# EasyEDA Pro project 2025_07_18_ftdi.epro

# Schematic Schematic1
Board Name: Board1; Create Date: 2025-07-18; Page Name: P1; Project Name: 2025_07_18_ftdi; Schematic Name: Schematic1; Update Date: 2025-07-18; Company: EasyEDA.com; Page Size: A4; Version: V1.0
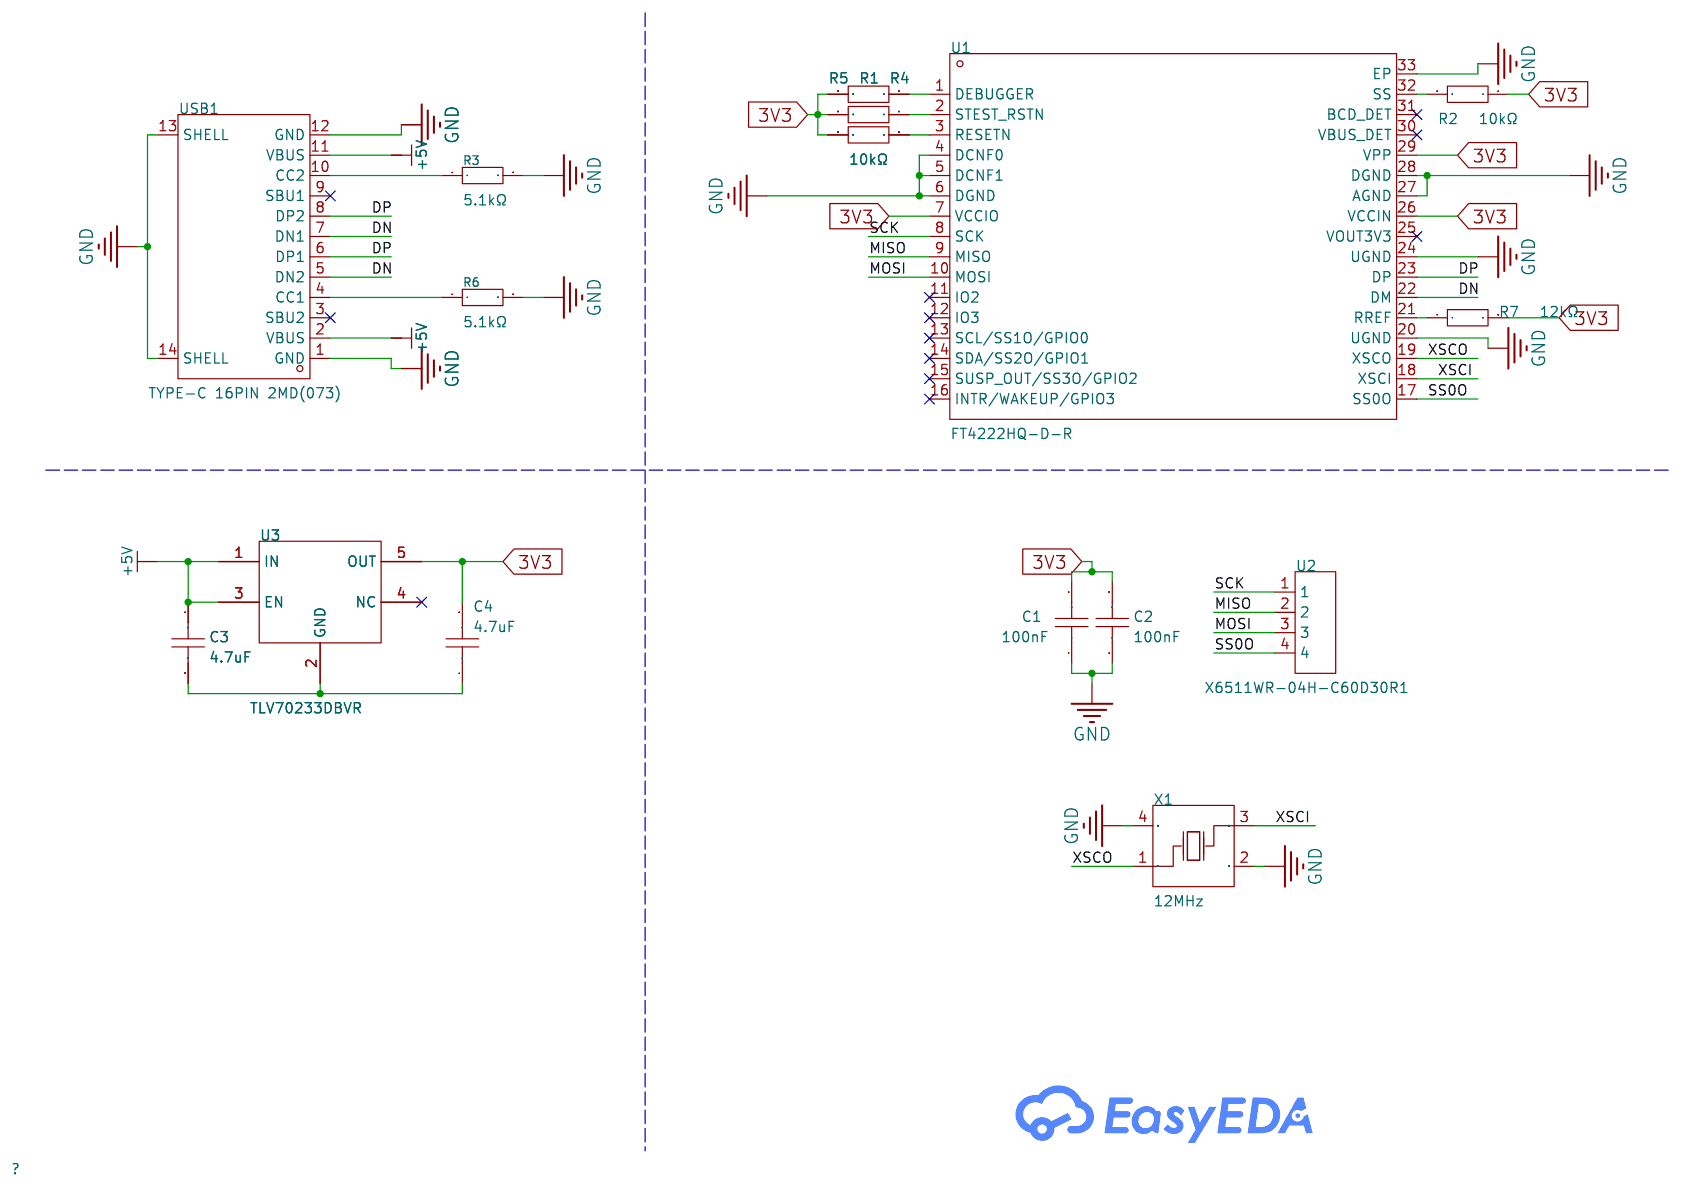
[diagram p0: schematic sheet]

## Parts
C1  100nF  [C0402]
C2  100nF  [C0402]
C3  4.7uF  [C0402]
C4  4.7uF  [C0402]
R1  10kΩ  [R0603]
R2  10kΩ  [R0603]
R3  5.1kΩ  [R0402]
R4  10kΩ  [R0603]
R5  10kΩ  [R0603]
R6  5.1kΩ  [R0402]
R7  12kΩ  [R0402]
U1  FT4222HQ-D-R  [QFN-32_L5.0-W5.0-P0.50-BL-EP3.7]
U2  X6511WR-04H-C60D30R1  [HDR-TH_4P-P2.54-H-M-W7.7-P]
U3  TLV70233DBVR  [SOT-23-5_L3.0-W1.7-P0.95-LS2.8-BR]
USB1  TYPE-C 16PIN 2MD(073)  [USB-C-SMD_TYPE-C-6PIN-2MD-073]
X1  12MHz  [CRYSTAL-SMD_4P-L3.2-W2.5-BL]

## Library data of the parts
C1 C2 = CL05B104KO5NNNC: Capacitance: Tolerance:±10% Tolerance:±10% Voltage Rated: Temperature Coefficient:; LCSC Part Name: 100nF ±10% 16V; Supplier Part: C1525; Manufacturer: SAMSUNG(三星); Supplier Footprint: 0402; JLCPCB Part Class: Basic Part; Datasheet: https://atta.szlcsc.com/upload/public/pdf/source/20160218/1457707763339.pdf; Supplier: LCSC; Tolerance: ±10%
C3 C4 = CL05A475MQ5NRNC_C307423: Capacitance: Tolerance:±20% Tolerance:±20% Voltage Rated: Temperature Coefficient:; LCSC Part Name: 4.7uF ±20% 6.3V; Supplier Part: C307423; Manufacturer: SAMSUNG(三星); Manufacturer Part: CL05A475MQ5NRNC; Supplier Footprint: 0402; JLCPCB Part Class: Extended Part; Datasheet: https://atta.szlcsc.com/upload/public/pdf/source/20181010/C307423_0E0C4E35F3A09F81C2E5C84E00499E42.pdf; Supplier: LCSC; Tolerance: ±20%
R1 R2 R4 R5 = RC0603FR-0710KL: Type:Thick Film Resistors Resistance: Tolerance:±1% Tolerance:±1% Power(Watts): Overload Voltage (Max): Temperature Coefficient:±100ppm/℃ Temperature Coefficient:±100ppm/℃ Operating Temperature Range:-55℃~+155℃ Operating Temperature Range:-55℃~+155℃; LCSC Part Name: 厚膜电阻 10kΩ ±1% 100mW; Supplier Part: C98220; Manufacturer: YAGEO(国巨); Supplier Footprint: 0603; JLCPCB Part Class: Extended Part; Datasheet: https://atta.szlcsc.com/upload/public/pdf/source/20180927/C295883_E8D83085EA81BD7DE0B2B681138C15EE.pdf; Supplier: LCSC; Type: Thick Film Resistors; Tolerance: ±1%; Temperature Coefficient: ±100ppm/℃; Operating Temperature Range: -55℃~+155℃
R3 R6 = 0402WGF5101TCE: Type:Thick Film Resistors Resistance:5.1kΩ Tolerance:±1% Tolerance:±1% Power(Watts): Overload Voltage (Max): Temperature Coefficient:±100ppm/℃ Temperature Coefficient:±100ppm/℃ Operating Temperature Range:-55℃~+155℃ Operating Temperature Range:-55℃~+155℃; LCSC Part Name: 5.1kΩ ±1% 62.5mW 厚膜电阻; Supplier Part: C25905; Manufacturer: UNI-ROYAL(厚声); Supplier Footprint: 0402; Datasheet: https://atta.szlcsc.com/upload/public/pdf/source/20200306/C422600_1E6D84923E4A46A82E41ADD87F860B5C.pdf; Supplier: LCSC; Type: Thick Film Resistors; Tolerance: ±1%; Temperature Coefficient: ±100ppm/℃; Operating Temperature Range: -55℃~+155℃
R7 = 0402WGF1202TCE: Type:Thick Film Resistors Resistance:12kΩ Tolerance:±1% Tolerance:±1% Power(Watts): Overload Voltage (Max): Temperature Coefficient:±100ppm/℃ Temperature Coefficient:±100ppm/℃ Operating Temperature Range:-55℃~+155℃ Operating Temperature Range:-55℃~+155℃; LCSC Part Name: 12kΩ ±1% 62.5mW 厚膜电阻; Supplier Part: C25752; Manufacturer: UNI-ROYAL(厚声); Supplier Footprint: 0402; JLCPCB Part Class: Basic Part; Datasheet: https://atta.szlcsc.com/upload/public/pdf/source/20200306/C422600_1E6D84923E4A46A82E41ADD87F860B5C.pdf; Supplier: LCSC; Type: Thick Film Resistors; Tolerance: ±1%; Temperature Coefficient: ±100ppm/℃; Operating Temperature Range: -55℃~+155℃
U1 = FT4222HQ-D-R: Applications Function:USB to SPI；USB to I2C USB Protocol:USB 2.0 Number of Channels:4 Voltage - Supply:1.8V；3.3V Voltage - Supply:1.8V；3.3V Data Rate:53.8Mbps Operating Temperature:-40℃~+85℃ Operating Temperature:-40℃~+85℃; LCSC Part Name: FT4222H USB2.0到QuadSPI/I2C桥接IC; Supplier Part: C5374752; Manufacturer: FTDI(飞特帝亚); Supplier Footprint: VQFN-32(5x5); JLCPCB Part Class: Extended Part; Datasheet: https://atta.szlcsc.com/upload/public/pdf/source/20221115/D0A0D91D7DBCFC567F5307977FAEF020.pdf; Supplier: LCSC; Applications Function: USB to SPI；USB to I2C; USB Protocol: USB 2.0; Number of Channels: 4; Voltage - Supply: 1.8V；3.3V; Data Rate: 53.8Mbps; Operating Temperature: -40℃~+85℃
U2 = X6511WR-04H-C60D30R1: Pin Structure:1x4P Pitch:2.54mm Row Spacing:2.54mm Circluar Pins/Square Pins:Policy Number of Rows:Single Row Number of Pins:4P Current Rating:3A Voltage Rating (Max):250V Length of Mating Pin:- Insulation Height:2.5mm Length of End Connection Pin:- Conta; LCSC Part Name: 1x4P 间距:2.54mm 方针; Supplier Part: C2883842; Manufacturer: XKB Connection(中国星坤); Supplier Footprint: 弯插,P=2.54mm; JLCPCB Part Class: Extended Part; Datasheet: https://atta.szlcsc.com/upload/public/pdf/source/20230727/6B7DE29FAB2BFF6AD45118642F36F31B.pdf; Supplier: LCSC; Pin Structure: 1x4P; Pitch: 2.54mm; Row Spacing: 2.54mm; Circluar Pins/Square Pins: Policy; Number of Rows: Single Row; Number of Pins: 4P; Current Rating: 3A; Voltage Rating (Max): 250V; Insulation Height: 2.5mm; Contact Material: Brass; Contact Plating: Gold; Operating Temperature: -40℃~+105℃; Color: Black
U3 = TLV70233DBVR: Output Type:Fixed Maximum Input Voltage:5.5V Output Voltage:3.3V Output Voltage:3.3V Output Current:300mA Power Supply Rejection Ratio (PSRR):68dB@(1kHz) Dropout Voltage:375mV@(300mA) standby current:55uA Feature:ESD Protection；Low ESR；Thermal Protection(; LCSC Part Name: 具有使能功能的 300mA、高 PSRR、低 IQ、低压降稳压器; Supplier Part: C26833; Manufacturer: TI(德州仪器); Supplier Footprint: SOT-23-5; JLCPCB Part Class: Extended Part; Datasheet: https://www.ti.com/cn/lit/gpn/tlv702; Supplier: LCSC; Output Type: Fixed; Maximum Input Voltage: 5.5V; Output Voltage: 3.3V; Output Current: 300mA; Power Supply Rejection Ratio (PSRR): 68dB@(1kHz); Dropout Voltage: 375mV@(300mA); standby current: 55uA; Feature: ESD Protection；Low ESR；Thermal Protection(TSD)；Under-voltage Lockout；Overcurrent Protection(OCP)；With ability; Operating Temperature: -40℃~+125℃@(Tj); Output Polarity: Positive electrode; Number of Outputs: 1
USB1 = TYPE-C 16PIN 2MD(073): Connector Type:Type-C Protocol Standard:USB 3.1 Gender:Female Mounting Type:Surface Mount, Right Angle Number of Contacts:16P Number of Ports:1 Current Rating-Power:3A Voltage Rating:5V Connect-Disconnect Life:5,000 Cycles Supplementary Features:- Center; LCSC Part Name: Type-C 母 卧贴; Supplier Part: C2765186; Manufacturer: SHOU HAN(首韩); Supplier Footprint: SMD; JLCPCB Part Class: Extended Part; Datasheet: https://atta.szlcsc.com/upload/public/pdf/source/20250506/FFB74EDFDFA0AC372CE4A8E4F739CCEF.pdf; Supplier: LCSC; Connector Type: Type-C; Protocol Standard: USB 3.1; Gender: Female; Mounting Type: Surface Mount, Right Angle; Number of Contacts: 16P; Number of Ports: 1; Current Rating-Power: 3A; Voltage Rating: 5V; Connect-Disconnect Life: 5,000 Cycles; Detection color: Black; Operating Temperature: -25℃~+85℃
X1 = X322512MSB4SI: Type:Surface Mount Crystal Frequency:12MHz Normal temperature Frequency Tolerance:±10ppm Normal temperature Frequency Tolerance:±10ppm Load Capacitance:20pF Frequency Stability:±20ppm Frequency Stability:±20ppm Operating Temperature:-40℃~+85℃ Operating Te; LCSC Part Name: YSX321SL 12MHZ 4P 3225 20PF ±10PPM -40~85℃ (±20PPM); Supplier Part: C9002; Manufacturer: YXC(扬兴晶振); Supplier Footprint: SMD3225-4P; JLCPCB Part Class: Basic Part; Datasheet: https://atta.szlcsc.com/upload/public/pdf/source/20240329/19D5F850207469550BEB00D7DFEDBC7A.pdf; Supplier: LCSC; Type: Surface Mount Crystal; Normal temperature Frequency Tolerance: ±10ppm; Load Capacitance: 20pF; Frequency Stability: ±20ppm; Operating Temperature: -40℃~+85℃

## Nets
3V3: C1.2 C2.2 C4.2 R1.2 R2.1 R4.2 R5.2 R7.2 U1.7(VCCIO) U1.26(VCCIN) U1.29(VPP) U3.5(OUT)
+5V: C3.1 U3.1(IN) U3.3(EN) USB1.2(VBUS) USB1.11(VBUS)
GND: C1.1 C2.1 R3.2 R6.2 U1.4(DCNF0) U1.5(DCNF1) U1.6(DGND) U1.20(UGND) U1.24(UGND) U1.27(AGND) U1.28(DGND) U1.33(EP) USB1.1(GND) USB1.12(GND) USB1.13(SHELL) USB1.14(SHELL) X1.2(GND) X1.4(GND)
DN: U1.22(DM) USB1.5(DN2) USB1.7(DN1)
DP: U1.23(DP) USB1.6(DP1) USB1.8(DP2)
MISO: U1.9(MISO) U2.2
MOSI: U1.10(MOSI) U2.3
SCK: U1.8(SCK) U2.1
SS0O: U1.17(SS0O) U2.4
XSCI: U1.18(XSCI) X1.3(OSC2)
XSCO: U1.19(XSCO) X1.1(OSC1)
$1N578: R3.1 USB1.10(CC2)
$1N782: R6.1 USB1.4(CC1)
$1N1007: C3.2 C4.1 U3.2(GND)
$1N1303: R5.1 U1.3(RESETN)
$1N1374: R1.1 U1.1(DEBUGGER)
$1N1422: R4.1 U1.2(STEST_RSTN)
$1N1764: R2.2 U1.32(SS)
$1N1940: R7.1 U1.21(RREF)

Not connected (* = marked no-connect by the designer): U1 11(IO2)* 12(IO3)* 13(SCL/SS1O/GPIO0)* 14(SDA/SS2O/GPIO1)* 15(SUSP_OUT/SS3O/GPIO2)* 16(INTR/WAKEUP/GPIO3)* 25(VOUT3V3)* 30(VBUS_DET)* 31(BCD_DET)*; U3 4(NC)*; USB1 3(SBU2)* 9(SBU1)*

# Board PCB1
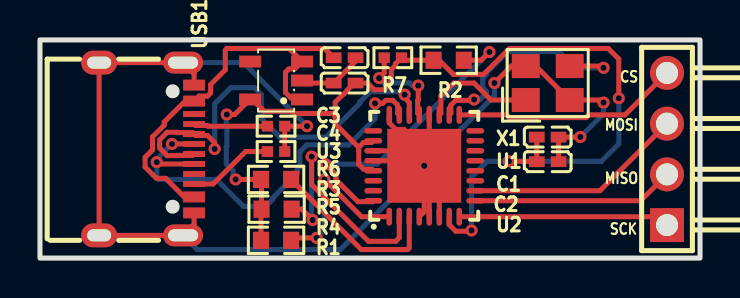
[diagram p1: board, top side]
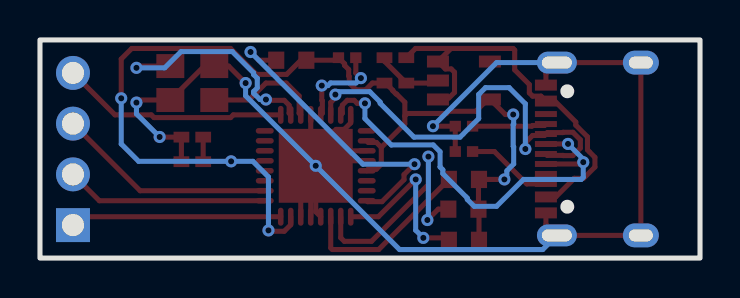
[diagram p2: board, bottom side, seen from below]

Outline 33.02 x 10.92 mm; copper layers: Top Layer, Bottom Layer. Coordinates in mm from the lower left corner of the outline.
Outline path: rectangle 0,10.92 33.02,0
Stack: Top Layer 0.035mm / Dielectric1 1.51mm FR4 er 4.5 / Bottom Layer 0.035mm

## Design rules (mm)
template: JLCPCB Capability(Two Layers Board)
spacing copperThickness1oz (default): track to track 0.102, other pairs 0.152 to 0.3
spacing copperThickness2oz: track to track 0.203, other pairs 0.152 to 0.3
track width copperThickness1oz (default): min 0.127, default 0.254, max 2.54
track width copperThickness2oz: min 0.203, default 0.254, max 2.54
differential pair differentialPair (default): width min 0.127, default 0.254, max 2.54; gap min 0.152, default 0.152
via viaSize (default): diameter min 0.5, default 0.61, max 10; hole min 0.3, default 0.305, max 6.3

## Placement (name value [footprint] x y rotation side)
C1  100nF  [C0402]  25.4 6.06 180 top
C2  100nF  [C0402]  25.4 4.83 180 top
C3  4.7uF  [C0402]  15.24 10.03 0 top
C4  4.7uF  [C0402]  15.24 8.76 0 top
R1  10kΩ  [R0603]  11.81 0.89 180 top
R2  10kΩ  [R0603]  20.45 9.91 0 top
R3  5.1kΩ  [R0402]  11.81 5.33 0 top
R4  10kΩ  [R0603]  11.84 2.45 180 top
R5  10kΩ  [R0603]  11.81 3.94 180 top
R6  5.1kΩ  [R0402]  11.81 6.6 0 top
R7  12kΩ  [R0402]  17.65 10.03 0 top
U1  FT4222HQ-D-R  [QFN-32_L5.0-W5.0-P0.50-BL-EP3.7]  19.22 4.62 0 top
U2  X6511WR-04H-C60D30R1  [HDR-TH_4P-P2.54-H-M-W7.7-P]  31.37 5.46 90 top
U3  TLV70233DBVR  [SOT-23-5_L3.0-W1.7-P0.95-LS2.8-BR]  11.81 8.89 0 top
USB1  TYPE-C 16PIN 2MD(073)  [USB-C-SMD_TYPE-C-6PIN-2MD-073]  5.33 5.46 270 top
X1  12MHz  [CRYSTAL-SMD_4P-L3.2-W2.5-BL]  25.4 8.76 0 top

## Footprints (pads in the part's own frame, mm; a bottom-side part is the same pattern mirrored in y, then rotated)
C0402
  rect 0.79x0.54 smd: 1(-0.545,0) 2(0.545,0)
CRYSTAL-SMD_4P-L3.2-W2.5-BL
  rect 1.4x1.2 smd: 1(-1.1,-0.85) 2(1.1,-0.85) 3(1.1,0.85) 4(-1.1,0.85)
HDR-TH_4P-P2.54-H-M-W7.7-P
  rect 1.7x1.7 hole 1.1: 1(-3.81,0)
  round 1.7 hole 1.1: 2(-1.27,0) 3(1.27,0) 4(3.81,0)
QFN-32_L5.0-W5.0-P0.50-BL-EP3.7
  oval 0.28x0.9 smd: 1(-1.75,-2.55) 2(-1.25,-2.55) 3(-0.75,-2.55) 4(-0.25,-2.55) 5(0.25,-2.55) 6(0.75,-2.55) 7(1.25,-2.55) 8(1.75,-2.55) 17(1.75,2.55) 18(1.25,2.55) 19(0.75,2.55) 20(0.25,2.55) 21(-0.25,2.55) 22(-0.75,2.55) 23(-1.25,2.55) 24(-1.75,2.55)
  oval 0.9x0.28 smd: 9(2.55,-1.75) 10(2.55,-1.25) 11(2.55,-0.75) 12(2.55,-0.25) 13(2.55,0.25) 14(2.55,0.75) 15(2.55,1.25) 16(2.55,1.75) 25(-2.55,1.75) 26(-2.55,1.25) 27(-2.55,0.75) 28(-2.55,0.25) 29(-2.55,-0.25) 30(-2.55,-0.75) 31(-2.55,-1.25) 32(-2.55,-1.75)
  rect 3.7x3.7 smd: 33(0,0)
R0402
  rect 0.566x0.54 smd: 1(-0.433,0) 2(0.433,0)
R0603
  rect 0.806x0.864 smd: 1(-0.753,0) 2(0.753,0)
SOT-23-5_L3.0-W1.7-P0.95-LS2.8-BR
  rect 1.1x0.6 smd: 1(1.3,-0.95) 2(1.3,0) 3(1.3,0.95) 4(-1.3,0.95) 5(-1.3,-0.95)
USB-C-SMD_TYPE-C-6PIN-2MD-073
  rect 0.55x1.1 smd: 1(-3.2,2.375) 2(-2.4,2.375) 11(2.4,2.375) 12(3.2,2.375)
  rect 0.3x1.1 smd: 3(-1.75,2.375) 4(-1.25,2.375) 5(-0.75,2.375) 6(-0.25,2.375) 7(0.25,2.375) 8(0.75,2.375) 9(1.25,2.375) 10(1.75,2.375)
  oval 1.1x2 hole 0.6x1.5: 13(-4.325,1.825) 14(4.325,1.825)
  oval 1.2x1.8 hole 0.6x1.2: 13(-4.325,-2.375) 14(4.325,-2.375)

## Nets
As in the schematic.

Pads without a net: U1 11 12 13 14 15 16 25 30 31; U3 4; USB1 3 9

## Via types
v1: diameter 0.61, hole 0.305, Top Layer to Bottom Layer, 25 vias

## Routing (per net, layer and track width the routed paths; a pad name or vN(x,y) marks a point on that pad's centre or on a via; arc(x,y) is an arc through that point)
3V3: length 55.5
  Top Layer w0.254: 15.95,5.54 16.19,5.79 16.59,5.79 U1.26 ; 15.95,5.54 15.95,4.7 16.19,4.45 16.59,4.45 U1.29 ; 15.95,5.54 14.77,6.72 14.77,7.11 ; 10.5,7.95 U3.5 ; 10.5,7.95 10.62,7.95 11.22,7.35 12.57,7.35 12.68,7.24 14.64,7.24 14.77,7.11 ; 10.5,7.95 9.74,7.19 v1(9.35,7.19) ; U1.7 20.47,1.67 20.8,1.34 21.55,1.34 v1(21.59,1.38) ; 24.85,6.06 C2.2 24.84,4.84 v1(23.46,4.84) ; v1(9.79,3.94) R5.2 11.08,3.91 R4.2 11.06,2.42 R1.2 ; 14.77,7.11 14.77,7.8 15.18,8.21 15.21,8.21 15.37,8.38 15.37,8.4 15.73,8.76 C4.2 16.39,8.76 16.72,8.43 17.21,8.43 17.55,8.77 17.55,9.09 17.58,9.12 17.58,9.44 17.78,9.65 17.78,9.73 R7.2 18.21,9.91 R2.1 19.97,9.91 20.68,9.19 22.19,9.19 23.49,10.49 28.43,10.49 28.96,9.97 v1(28.96,8)
  Bottom Layer w0.254: v1(9.35,7.19) 9.35,7.16 9.32,7.14 9.32,6.71 9.35,6.68 9.35,5.6 9.32,5.58 9.32,4.71 9.66,4.37 9.66,4.06 v1(9.79,3.94) ; v1(21.59,1.38) 21.59,4.06 22.37,4.84 v1(23.46,4.84) 28.08,4.84 28.96,5.72 v1(28.96,8)
+5V: length 20.1
  Top Layer w0.254: C3.1 14.23,10.49 12.46,10.49 ; 12.46,10.49 U3.3 12.74,9.47 12.45,9.47 12.28,9.31 12.28,8.29 12.57,8 ; 12.46,10.49 9.35,10.49 9.27,10.41 9.27,9.42 8.54,8.69 8.54,8.27 8.37,8.11 7.96,8.11 USB1.2 7.26,7.86 6.21,6.81 6.21,6.66 5.63,6.07 5.63,5.42 5.53,5.32 ; 5.53,5.32 5.26,5.04 5.26,4.56 5.82,3.99 6.28,3.99 7.22,3.06 USB1.11
GND: length 78.9
  Top Layer w0.254: 17.47,7.17 17.47,6.77 17.8,6.44 18.2,6.44 19.22,5.42 v1(19.22,4.62) ; v1(19.22,4.62) 19.47,4.87 19.47,7.17 ; v1(19.22,4.62) 19.22,2.32 U1.4 ; U1.27 18.47,5.37 18.97,4.87 U1.28 ; USB1.1 7.71,9.24 USB1.13 USB1.13 USB1.14 USB1.14 7.71,1.69 USB1.12 ; R3.2 R6.2 v1(13.36,6.6) ; U1.6 19.97,3.87 19.47,4.37 U1.5 ; v1(22.73,8.76) 23.58,9.61 24.8,9.61 X1.2 28.07,7.91 v1(28.19,7.79) ; C2.1 C1.1 27.03,6.06 v1(27.03,6.06)
  Bottom Layer w0.254: v1(13.36,6.6) 10.18,9.79 USB1.13 ; v1(27.03,6.06) 28.19,7.22 v1(28.19,7.79) ; USB1.14 7.87,0.43 15.03,0.43 v1(19.22,4.62) 22.73,8.13 v1(22.73,8.76)
DN: length 21.8
  Top Layer w0.254: v1(18.24,8.18) 18.24,8.02 18.47,7.79 18.47,7.17 ; USB1.7 7.64,5.14 6.85,5.14 6.85,5.13 6.36,5.13 5.99,5.51 5.99,5.92 6.36,6.3 6.85,6.3 6.86,6.28 7.64,6.28 USB1.5 7.78,6.14 8.37,6.14 8.74,5.78 v1(8.74,5.46)
  Bottom Layer w0.254: v1(18.24,8.18) 18.1,8.33 16.52,8.33 16,7.81 16,7.75 14.31,6.05 12,6.05 11.07,6.98 11.07,8.19 10.73,8.53 9.55,8.53 8.74,7.72 v1(8.74,5.46)
DP: length 21.5
  Top Layer w0.254: v1(6.6,5.72) 7.71,5.72 USB1.6 ; USB1.8 5.93,4.71 v1(5.84,4.8) ; v1(16.76,7.75) 17.15,7.75 17.3,7.9 17.65,7.9 17.89,7.65 17.89,7.25 17.97,7.17
  Bottom Layer w0.254: v1(16.76,7.75) 16.76,6.98 15.44,5.66 13.35,5.66 13,5.32 13,4.56 12.87,4.42 12.87,4.23 11.64,3.01 11.64,2.93 11.3,2.59 10.18,2.59 8.83,3.94 5.94,3.94 5.84,4.04 v1(5.84,4.8) 5.84,4.95 v1(6.6,5.72)
MISO: length 10.1
  Top Layer w0.254: 21.78,2.87 30.05,2.87 U2.2
MOSI: length 11
  Top Layer w0.254: U2.3 28.01,3.37 21.78,3.37
SCK: length 10.6
  Top Layer w0.254: U2.1 30.95,2.07 U1.8
SS0O: length 11.4
  Top Layer w0.254: U2.4 29.27,7.17 27.45,7.17 27.32,7.03 23.48,7.03 23.35,7.17 20.97,7.17
XSCI: length 12.1
  Top Layer w0.254: v1(28.19,9.52) 28.11,9.61 26.5,9.61 ; v1(21.72,7.94) 21.68,7.9 20.8,7.9 20.56,7.65 20.56,7.25 20.47,7.17
  Bottom Layer w0.254: v1(28.19,9.52) 26.78,9.52 25.96,10.34 23.4,10.34 22.33,9.27 22.33,9.19 22.15,9 22.15,8.52 22.33,8.34 22.33,8.25 22.01,7.94 v1(21.72,7.94)
XSCO: length 5.8
  Top Layer w0.254: X1.1 22.57,7.91 21.72,8.76 20.7,8.76 20.06,8.12 20.06,7.25 19.97,7.17
$1N578: length 4.3
  Top Layer w0.254: USB1.10 8.66,3.71 10.29,5.33 R3.1
$1N782: length 3.7
  Top Layer w0.254: USB1.4 7.78,6.64 8.37,6.64 8.41,6.6 R6.1
$1N1007: length 3.4
  Top Layer w0.254: C3.2 15.78,9.85 C4.1 13.24,8.76 U3.2
$1N1303: length 9
  Top Layer w0.254: R5.1 16.07,0.43 18.39,0.43 18.47,0.51 U1.3
$1N1374: length 8.4
  Top Layer w0.254: R1.1 12.69,1.01 v1(13.84,1.01) ; U1.1 16.09,2.07 v1(14.22,3.94)
  Bottom Layer w0.254: v1(13.84,1.01) 14.22,1.39 v1(14.22,3.94)
$1N1422: length 12.6
  Top Layer w0.254: v1(13.64,1.91) 13.1,2.45 R4.1 ; U1.2 17.97,1.02 17.79,0.84 16.44,0.84 13.59,3.68 v1(13.59,5.08)
  Bottom Layer w0.254: v1(13.64,1.91) 13.59,1.96 v1(13.59,5.08)
$1N1764: length 15.3
  Top Layer w0.254: R2.2 22.07,9.91 v1(22.48,10.32) ; U1.32 16.63,2.82 15.91,2.82 14.81,3.92 14.81,4.18 14.35,4.64 14.35,4.64 v1(14.28,4.7)
  Bottom Layer w0.254: v1(22.48,10.32) 16.87,4.7 v1(14.28,4.7)
$1N1940: length 4.8
  Top Layer w0.254: v1(16.97,9.01) 17.22,9.26 R7.1 ; v1(18.92,8.64) 18.92,7.91 18.89,7.88 18.89,7.25 18.97,7.17
  Bottom Layer w0.254: v1(18.92,8.64) 18.62,8.64 18.49,8.77 17.21,8.77 v1(16.97,9.01)

## Text on the board
Top Silkscreen Layer: MOSI | MISO | SCK | CS
